# EAGLE schematic basic_circuit (EAGLE 9.6.2)
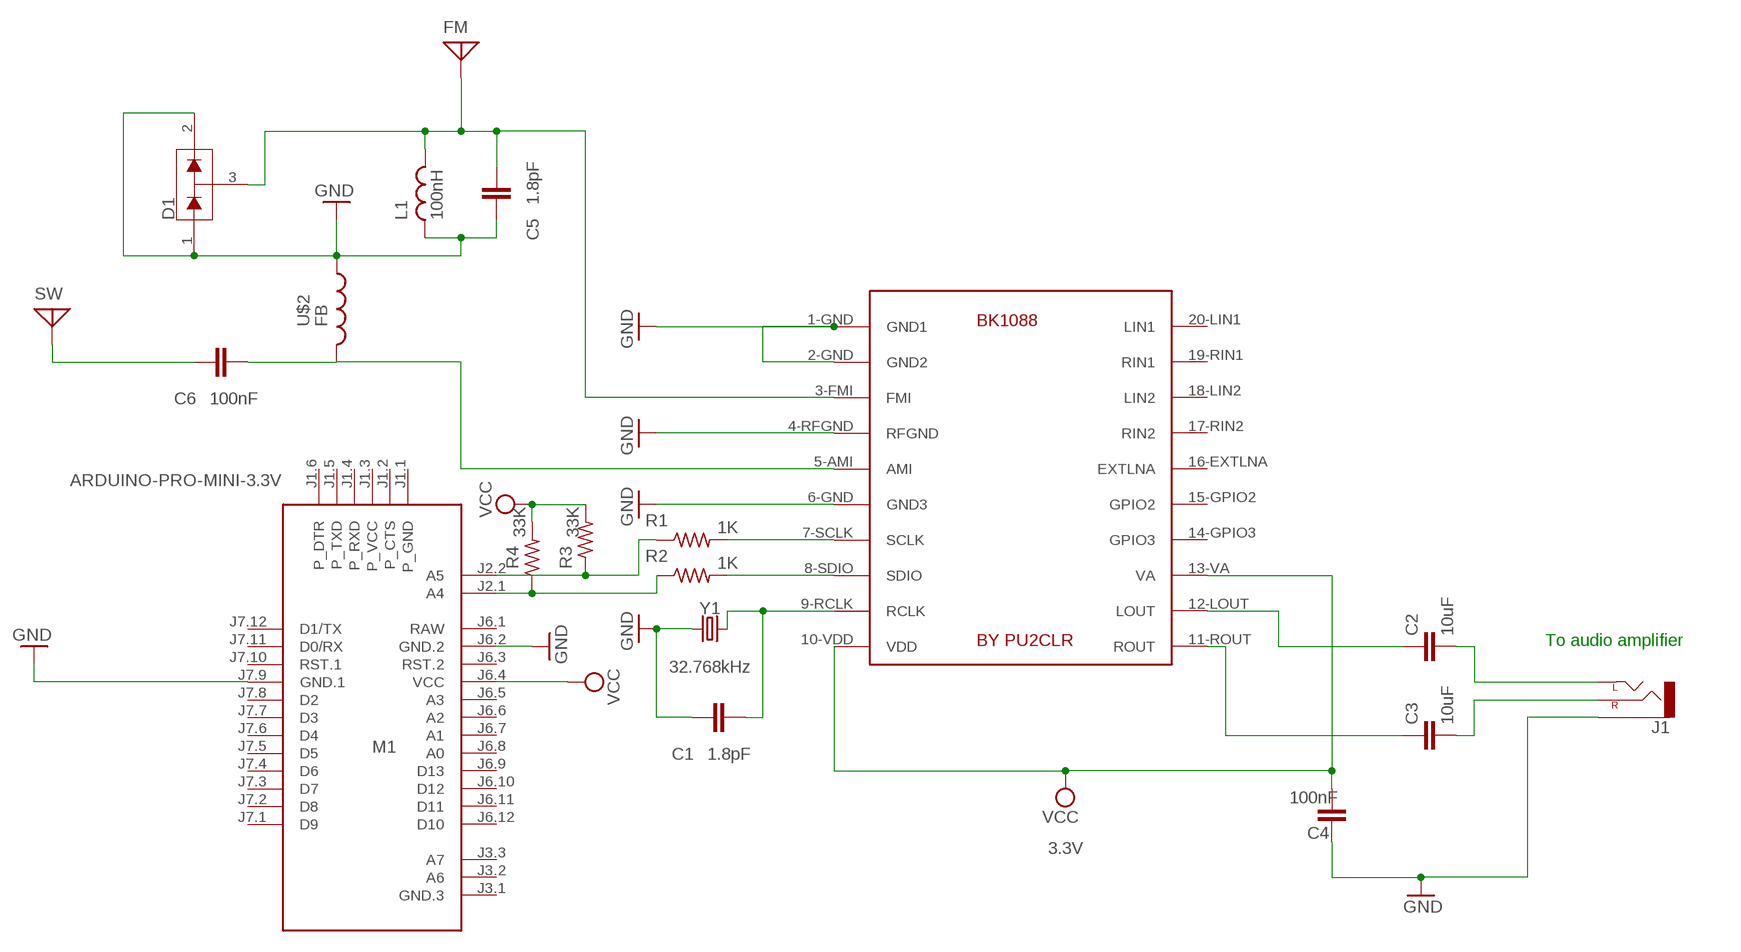
[diagram p0: schematic, sheet 1]

## Parts
C1  1.8pF  C5/3  [C5B3]
C2  10uF  10UF-0603-6.3V-20%  [0603]
C3  10uF  10UF-0603-6.3V-20%  [0603]
C4  100nF  C5/3  [C5B3]
C5  1.8pF  C5/3  [C5B3]
C6  100nF  C5/3  [C5B3]
D1  200mA/70V  BAV99  [SOT23-3]
FM  ANTENNA  [PAD-01]
J1  AUDIO_JACK_2.5MMSPECIAL_POGO_PINS  [STEREOJACK2.5MM_SPECIAL_POGOPINS]
L1  100nH  L  (no package)
M1  ARDUINO-PRO-MINI-3.3V  [ARDUINO-PRO-MINI]
R1  1K  R-US_AXIAL-7.2MM-PITCH  [RESAD724W46L381D178B]
R2  1K  R-US_AXIAL-7.2MM-PITCH  [RESAD724W46L381D178B]
R3  33K  R-US_AXIAL-7.2MM-PITCH  [RESAD724W46L381D178B]
R4  33K  R-US_AXIAL-7.2MM-PITCH  [RESAD724W46L381D178B]
SW  ANTENNA  [PAD-01]
U$1  BK1088BK1088  [SOIC127P1032X265-20N]
U$2  FB  [FB]
Y1  32.768kHz  CRYSTAL-32.768KHZPTH-2X6  [CRYSTAL-PTH-2X6-CYL]

## Nets
GND: C1.1 C4.2 C5.1 D1.1(A1) D1.2(C2) J1.RING1(SLEEVE) L1.1 M1.J6.2(GND.2) M1.J7.9(GND.1) U$1.1-GND(GND1) U$1.2-GND(GND2) U$1.4-RFGND(RFGND) U$1.6-GND(GND3) U$2.P$1 Y1.1
N$1: R1.2 U$1.7-SCLK(SCLK)
N$2: R2.2 U$1.8-SDIO(SDIO)
N$3: M1.J2.1(A4) R2.1 R4.1
N$4: M1.J2.2(A5) R1.1 R3.1
N$5: C1.2 U$1.9-RCLK(RCLK) Y1.2
N$6: C3.1 U$1.11-ROUT(ROUT)
N$7: C2.1 U$1.12-LOUT(LOUT)
N$8: C3.2 J1.TIP(RIGHT)
N$9: C2.2 J1.SHIELD(LEFT)
N$10: C6.2 U$1.5-AMI(AMI) U$2.P$2
N$11: C6.1 SW.1
N$12: C5.2 D1.3(COM) FM.1 L1.2 U$1.3-FMI(FMI)
VCC: C4.1 M1.J6.4(VCC) R3.2 R4.2 U$1.10-VDD(VDD) U$1.13-VA(VA)
Unconnected: M1.J1.1(P_GND) M1.J1.2(P_CTS) M1.J1.3(P_VCC) M1.J1.4(P_RXD) M1.J1.5(P_TXD) M1.J1.6(P_DTR) M1.J3.1(GND.3) M1.J3.2(A6) M1.J3.3(A7) M1.J6.3(RST.2) M1.J6.5(A3) M1.J6.6(A2) M1.J6.7(A1) M1.J6.8(A0) M1.J6.9(D13) M1.J6.10(D12) M1.J6.11(D11) M1.J6.12(D10) M1.J7.1(D9) M1.J7.2(D8) M1.J7.3(D7) M1.J7.4(D6) M1.J7.5(D5) M1.J7.6(D4) M1.J7.7(D3) M1.J7.8(D2) M1.J7.10(RST.1) M1.J7.11(D0/RX) M1.J7.12(D1/TX) U$1.14-GPIO3(GPIO3) U$1.15-GPIO2(GPIO2) U$1.16-EXTLNA(EXTLNA) U$1.17-RIN2(RIN2) U$1.18-LIN2(LIN2) U$1.19-RIN1(RIN1) U$1.20-LIN1(LIN1)

## Notes on the sheet
- To audio amplifier

## Power pins joined to a net without a drawn wire
RAW: M1.J6.1(RAW)

## Library data of the parts
C1 C4-C6 = capacitor-wima:C: CAPACITOR naming: grid - package width
C2 C3 = SparkFun-Capacitors:10UF: 10.0µF ceramic capacitors A capacitor is a passive two-terminal electrical component used to store electrical energy temporarily in an electric field.; PROD_ID: CAP-11015
D1 = SparkFun-DiscreteSemi:BAV99: Series-pair diode array Two small signal silicon diodes connected anode to cathode. Connections to all three nodes available. Link to datasheet <https://www.fairchildsemi.com/datasheets/BA/BAV99.pdf> SparkFun Products: SparkFun AutoDriver <https://www.sparkfun.com/products/13752>; PROD_ID: DIO-10647
FM SW = discrete:ANTENNA: Antenna
J1 = SparkFun-Connectors:AUDIO_JACK_2.5MM: Audio Jack 2.5mm variants of PTH and SMT audio jacks. SparkFun Products: SparkFun PicoBoard <https://www.sparkfun.com/products/11888>- 2.5mm SMD
L1 = ngspice-simulation:L: INDUCTOR
M1 = diy-modules:ARDUINO-PRO-MINI-*: Arduino Pro Mini and compatible devices More details available here: https://www.arduino.cc/en/Main/ArduinoBoardProMini Click here to find device on ebay.com <http://www.ebay.com/sch/arduino+pro+mini>
R1-R4 = Resistor:R-US: Resistor Fixed - ANSI; CATEGORY: Resistor; SUB-CATEGORY: Fixed
U$1 = BK1088:BK1088: BK1088
U$2 = adafruit:FB: Ferrite bead Digikey #P9821BK-ND
Y1 = SparkFun-Clocks:CRYSTAL-32.768KHZ: 32.768kHz Crystal Frequency: 32.768kHz Frequency Stability: ±20ppm Load Capacitance: 12.5pF (PTH-2X6 & SMD-3.2X1.5), 6pF (SMD-2X6) SparkFun Products: SparkFun BigTime Watch Kit <https://www.sparkfun.com/products/11734> SparkFun nRF52832 Breakout <https://www.sparkfun.com/products/13990> SparkFun Real Time Clock Module <https://www.sparkfun.com/products/12708>; PROD_ID: XTAL-10112